# Altium schematic sheet FPGA_Digilent_Spartan2E_Digilab_2FT.SchDoc: Example for Digilent Digilab 2FT Board
size A; SheetNumber: 1; SheetTotal: 1; Address1: L3, 12a Rodborough Rd; Address2: Frenchs Forest; Address3: NSW; Address4: Australia 2086; Organization: Altium Limited
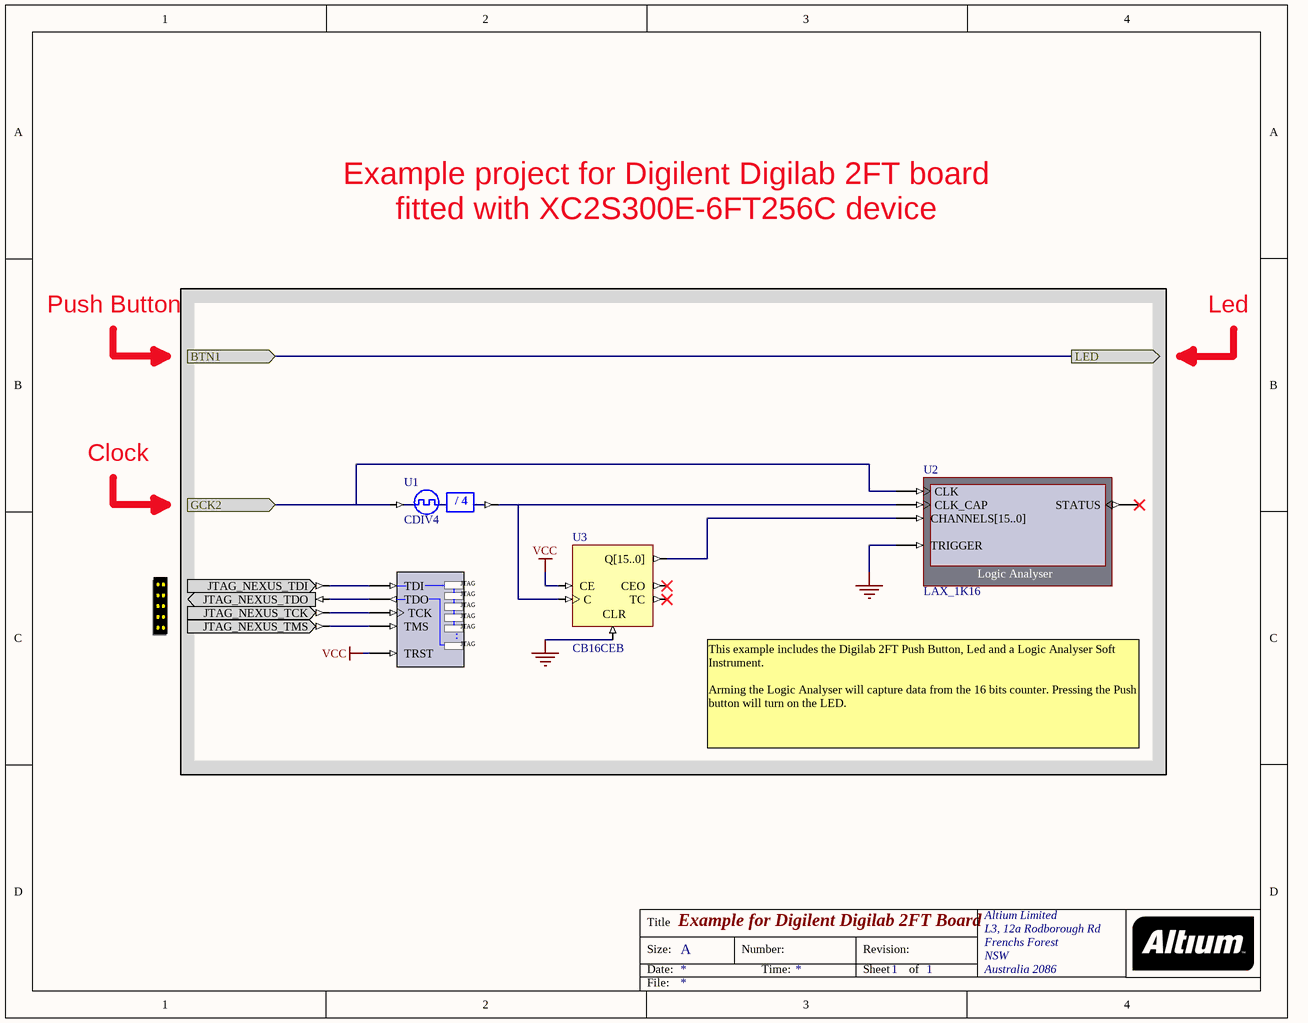
[diagram p0: FPGA_Digilent_Spartan2E_Digilab_2FT.SchDoc]

## Parts
?  NEXUS_JTAG_CONNECTOR  (value not drawn)
NEXUS_JTAG_PORT  NEXUS_JTAG_PORT  (value not drawn)
U1  CDIV4
U2  LAX_1K16
U3  CB16CEB

## Ports
BTN1 (in), GCK2 (in), LED (out)

## Nets
GND: U2.TRIGGER U3.CLR
VCC: NEXUS_JTAG_PORT.TRST U3.CE
BTN1: port BTN1, port LED
GCK2: U1.CLKIN U2.CLK ; port GCK2
Net?_JTAG_NEXUS_TCK: ?.JTAG_NEXUS_TCK NEXUS_JTAG_PORT.TCK
Net?_JTAG_NEXUS_TDI: ?.JTAG_NEXUS_TDI NEXUS_JTAG_PORT.TDI
Net?_JTAG_NEXUS_TDO: ?.JTAG_NEXUS_TDO NEXUS_JTAG_PORT.TDO
Net?_JTAG_NEXUS_TMS: ?.JTAG_NEXUS_TMS NEXUS_JTAG_PORT.TMS
NetU1_CLKDV: U1.CLKDV U2.CLK_CAP U3.C
NetU2_CHANNELS[15..0]: U2.CHANNELS[15..0] U3.Q[15..0]

Not connected (* = marked no-connect by the designer): U2 STATUS*; U3 CEO* TC*

## Notes on the sheet
- Example project for Digilent Digilab 2FT board
  fitted with XC2S300E-6FT256C device
- Push Button
- Led
- Clock
- This example includes the Digilab 2FT Push Button, Led and a Logic Analyser Soft Instrument.
  Arming the Logic Analyser will capture data from the 16 bits counter. Pressing the Push button will turn on the LED.
- Title
- Size:
- Date:
- A
- Number:
- Time:
- Revision:
- Sheet
- of
- File:
- (in symbol CDIV4) / 4
- (in symbol LAX_1K16) Logic Analyser
- (in symbol NEXUS_JTAG_PORT) JTAG; .

## Library data of the parts
? = NEXUS_JTAG_CONNECTOR: JTAG Port; PortComponent: True; Published: 19-Nov-2003; Publisher: Altium Limited
NEXUS_JTAG_PORT = NEXUS_JTAG_PORT: Soft Nexus-Chain Connector; NEXUS_JTAG_CONNECTOR: True; Published: 18-Dec-2003; Publisher: Altium Limited
U1 = CDIV4: Clock Divider by 4; ArchiveName: GENERIC; Published: 18-Dec-2003; Publisher: Altium Limited; Core Revision: 1.00.00
U2 = LAX_1K16: Logic Analyser 1K16; NEXUS_CORE: Instrument; NEXUS_JTAG_DEVICE: True; NEXUS_JTAG_ORDER: 0; ChildModel1: RAM1KX16_LA16_1K; Published: 24/11/2003; Publisher: Altium Hobart Technology Centre; Core Revision: 1.00.00
U3 = CB16CEB: 16-Bit Cascadable Binary Counters with Clock Enable and Asynchronous Clear, Bus Version; Xilinx Equivalent: CB16CE; ArchiveName: GENERIC; Published: 18-Dec-2003; Publisher: Altium Limited; Core Revision: 1.00.00